# EAGLE design carrier1 (EAGLE 8.3.0)
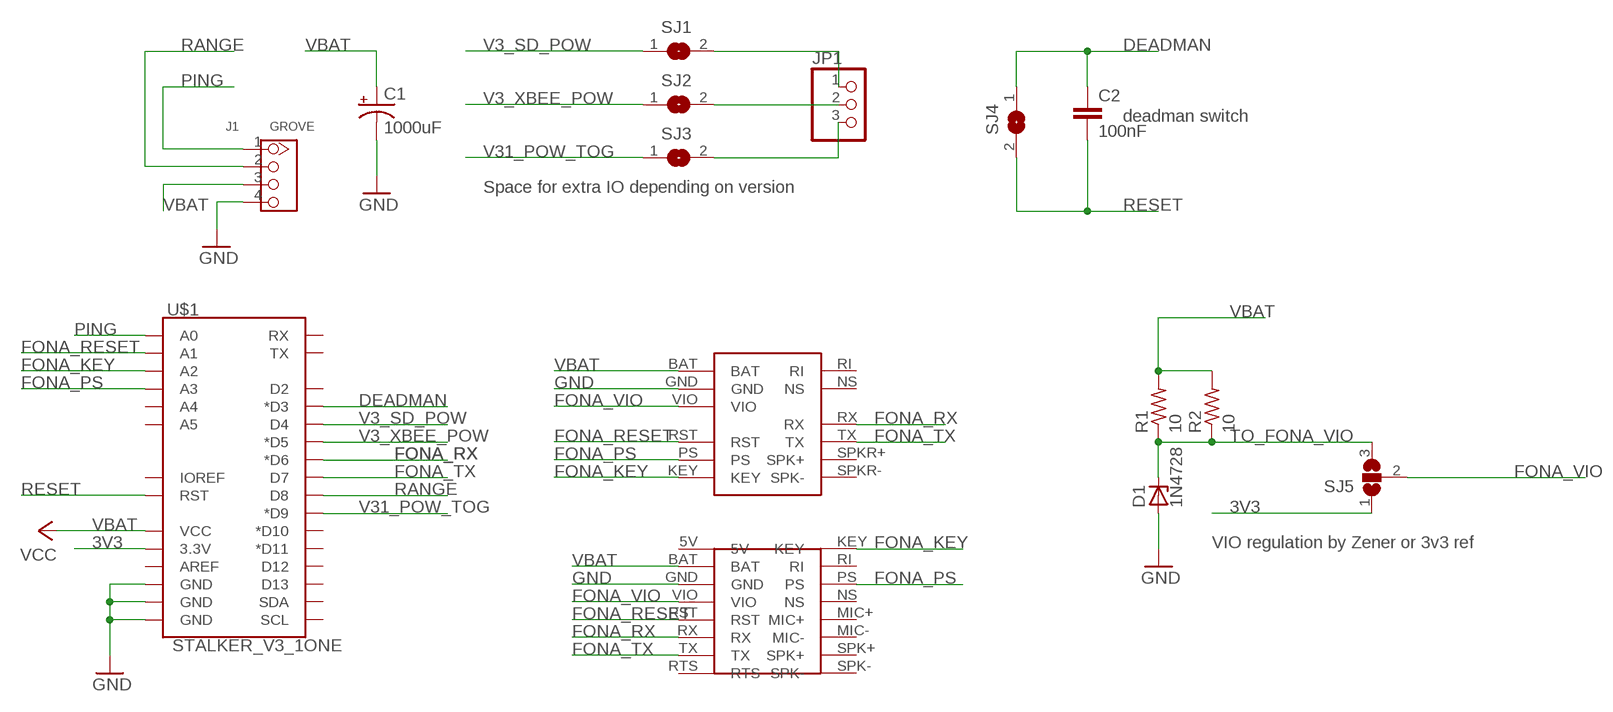
[diagram p0: schematic, sheet 1]

## Parts
C1  1000uF  CPOL-USE3.5-8  [E3,5-8]
C2  100nF  C-EUC0805  [C0805]
D1  1N4728  [DO41Z10]
J1  GROVE  GROVE-CONNECTOR-DIP(4P-2.0)  [HW4-2.0]
JP1  PINHD-1X3  [1X03]
R1  10  R-US_R0805  [R0805]
R2  10  R-US_0207/10  [0207/10]
SJ1  SJ  [SJ]
SJ2  SJ  [SJ]
SJ3  SJ  [SJ]
SJ4  SJ  [SJ]
SJ5  SJ2W  [SJ_2]
U$1  STALKER_V3_1ONE  [STALKER_V3_1_PACKAGE]
U$2  FONA_800_BREAKOUTONE  [FONA_800_H_L_BREAKOUT]
U$3  FONA_808_BREAKOUTONE  [FONA_808_BREAKOUT]

## Nets
3V3: SJ5.1 U$1.3.3V
DEADMAN: C2.1 SJ4.1 U$1.D3(*D3)
FONA_KEY: U$1.A2 U$2.KEY U$3.KEY
FONA_PS: U$1.A3 U$2.PS U$3.PS
FONA_RESET: U$1.A1 U$2.RST U$3.RST
FONA_RX: U$1.D6(*D6) U$2.RX U$3.RX
FONA_TX: U$1.D7 U$2.TX U$3.TX
FONA_VIO: SJ5.2 U$2.VIO U$3.VIO
GND: C1.- D1.A J1.4 U$1.GND@0(GND) U$1.GND@1(GND) U$1.GND@2(GND) U$2.GND U$3.GND
N$1: JP1.1 SJ1.2
N$2: JP1.2 SJ2.2
N$3: JP1.3 SJ3.2
PING: J1.1 U$1.A0
RANGE: J1.2 U$1.D8
RESET: C2.2 SJ4.2 U$1.RES(RST)
TO_FONA_VIO: D1.C R1.1 R2.1 SJ5.3
V3_SD_POW: SJ1.1 U$1.D4
V3_XBEE_POW: SJ2.1 U$1.D5(*D5)
V31_POW_TOG: SJ3.1 U$1.D9(*D9)
VBAT [POWER]: C1.+ J1.3 R1.2 R2.2 U$1.VCC U$2.BAT U$3.BAT ; supply symbol labelled VCC
Unconnected: U$1.A4 U$1.A5 U$1.AREF U$1.D2 U$1.D10(*D10) U$1.D11(*D11) U$1.D12 U$1.D13 U$1.IOREF U$1.RX U$1.SCL U$1.SDA U$1.TX U$2.NS U$2.RI U$2.SPKR+(SPK+) U$2.SPKR-(SPK-) U$3.MIC+ U$3.MIC- U$3.NS U$3.RI U$3.RTS U$3.SPK+ U$3.SPK-

## Notes on the sheet
- deadman switch
- Space for extra IO depending on version
- VIO regulation by Zener or 3v3 ref

## Power pins joined to a net without a drawn wire
5V: U$3.5V

## Library data of the parts
C1 = rcl:CPOL-US: POLARIZED CAPACITOR, American symbol
C2 = rcl:C-EU: CAPACITOR, European symbol
D1 = diode:1N4728: Z DIODE 3.3 V, 1W, 5 percent
J1 = TepmachchaMk2:GROVE-CONNECTOR-DIP(4P-2.0): 320110033; VALUE: 4P-2.0
JP1 = pinhead:PINHD-1X3: PIN HEADER
R1 R2 = rcl:R-US_: RESISTOR, American symbol
SJ1-SJ4 = jumper:SJ: SMD solder JUMPER
SJ5 = jumper:SJ2W: SMD solder JUMPER
U$1 = TepmachchaMk2:STALKER_V3_1: Stalker V3.1 device
U$2 = TepmachchaMk2:FONA_800_BREAKOUT: Adafruit FONA 800 H or L breakout board footprint and dimensions
U$3 = TepmachchaMk2:FONA_808_BREAKOUT

## Net classes
1 POWER: width 2.032 mm, drill 0.508 mm, clearance 1.016 mm

## Board
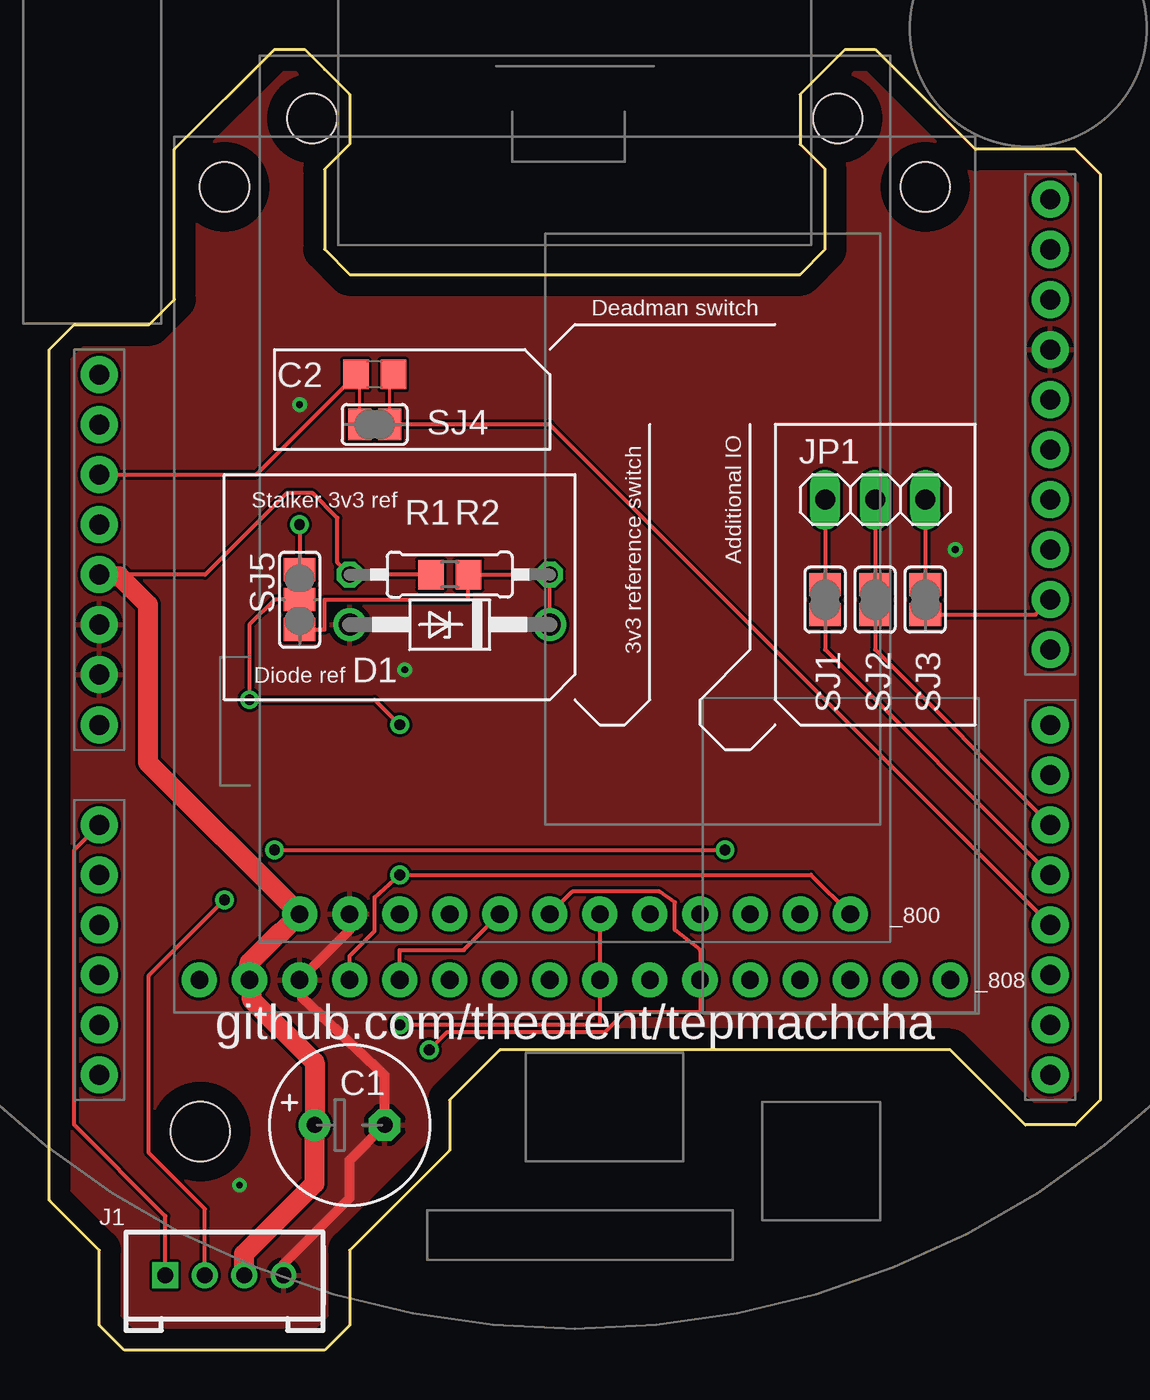
[diagram p1: board, top side]
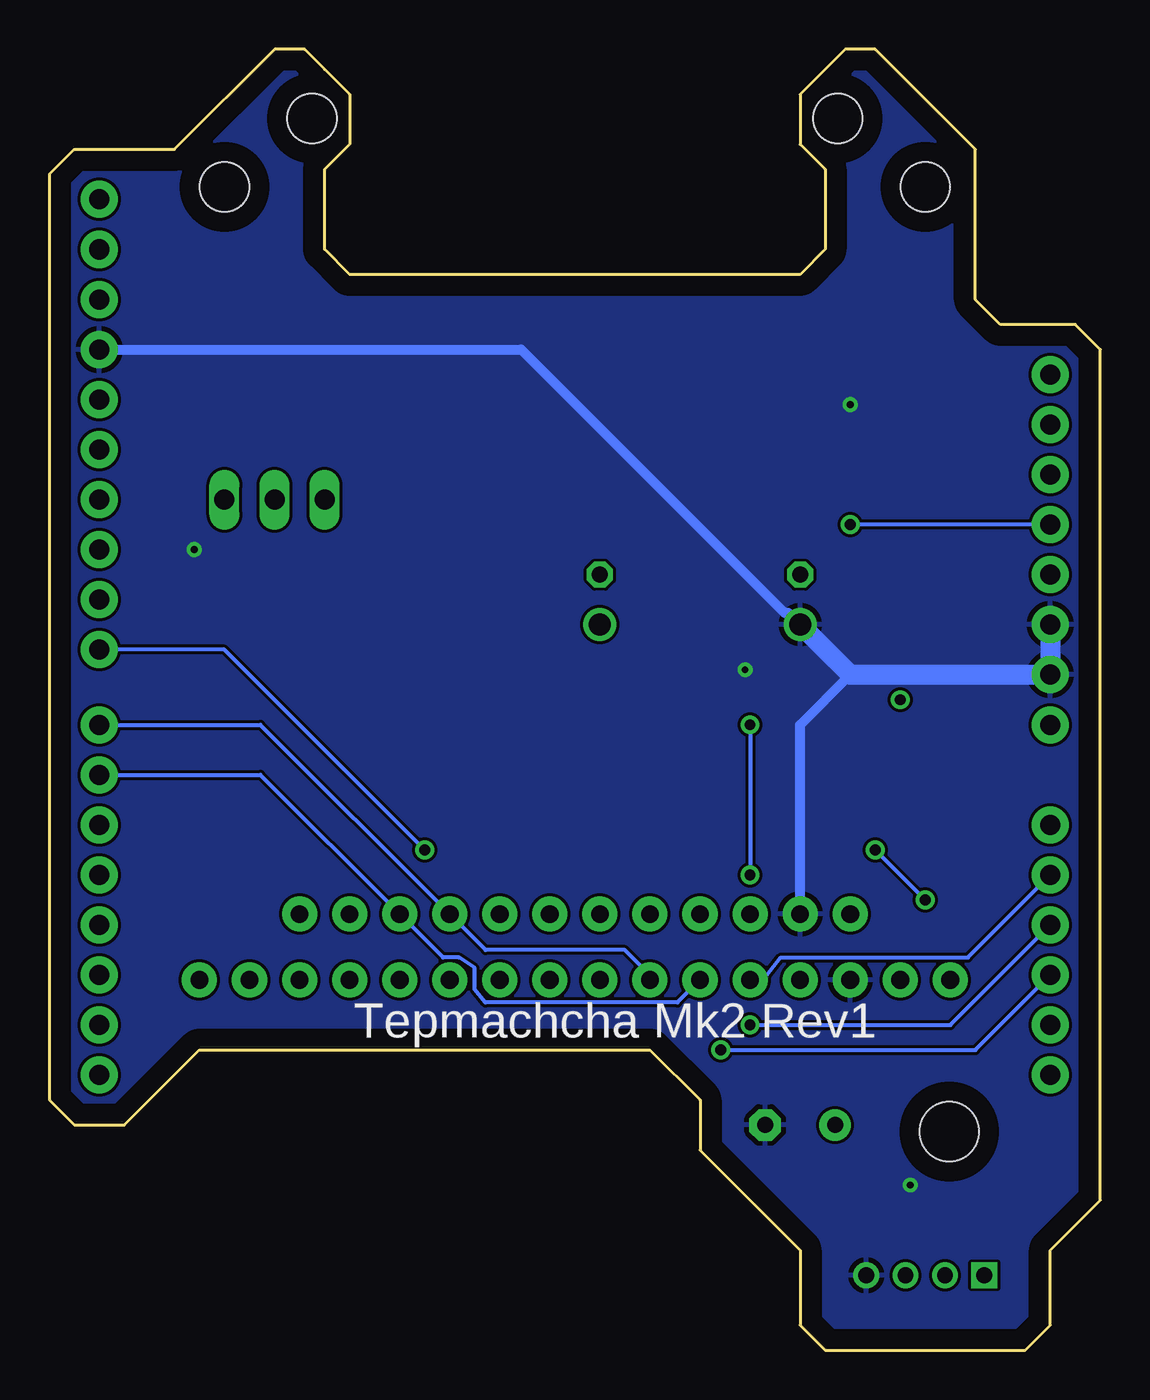
[diagram p2: board, bottom side, seen from below]

Size 53.34 x 66.04 mm. Coordinates in mm from the lower left corner, seen from the top.
Outline: 0,7.62 0,50.8 1.27,52.07 5.08,52.07 6.35,53.34 6.35,60.96 11.43,66.04 12.95,66.04 13.97,65.02 15.24,63.75 15.24,61.21 13.97,59.94 13.97,55.88 15.24,54.61 38.1,54.61 39.37,55.88 39.37,59.94 38.1,61.21 38.1,63.75 39.37,65.02 40.39,66.04 41.91,66.04 46.99,60.96 52.07,60.96 53.34,59.69 53.34,12.7 52.07,11.43 49.53,11.43 45.72,15.24 22.86,15.24 20.32,12.7 20.32,10.16 15.24,5.08 15.24,1.27 13.97,0 3.81,0 2.54,1.27 2.54,5.08 0,7.62
Copper layers (1*16): Top 0.035mm / dielectric 1.5mm / Bottom 0.035mm
Design rules "default": minimum track width 6mil, minimum drill 0.35mm, track to track 6mil, track to pad 6mil, pad to pad 6mil, via to via 6mil, smd to smd 6mil, copper to edge 40mil, drill to drill 6mil, minimum pad ring 10mil, minimum via ring 8mil, stop-mask expansion 4mil, vias tented up to drill 0mil, thermal gap 10mil

### Footprints (pad centres in the part's own frame; a part is rotated, then mirrored left to right if it is on the bottom)
E3,5-8 = drill 0.813 pad 1.6: + -1.778,0 | drill 0.813 pad 1.6 octagon: - 1.778,0
C0805 = smd 1.3 x 1.5: 1 -0.95,0; 2 0.95,0
DO41Z10 = drill 1.118: A 5.08,0; C -5.08,0
HW4-2.0 = drill 0.8 pad 1.27 square: 1 -3,0 | drill 0.8 pad 1.27: 2 -1,0; 3 1,0; 4 3,0
1X03 = drill 1.016 long: 1 -2.54,0; 2 0,0; 3 2.54,0
R0805 = smd 1.3 x 1.5: 1 -0.95,0; 2 0.95,0
0207/10 = drill 0.813 octagon: 1 -5.08,0; 2 5.08,0
SJ = smd 1.168 x 1.6: 1 -0.762,0; 2 0.762,0
SJ_2 = smd 1.168 x 1.6: 1 -1.524,0; 2 0,0; 3 1.524,0
STALKER_V3_1_PACKAGE = drill 1.016 pad 1.88: 3.3V -24.13,3.81; A0 -24.13,-11.43; A1 -24.13,-13.97; A2 -24.13,-16.51; A3 -24.13,-19.05; A4 -24.13,-21.59; A5 -24.13,-24.13; AREF 24.13,15.24; D2 24.13,-19.05; D3 24.13,-16.51; D4 24.13,-13.97; D5 24.13,-11.43; D6 24.13,-8.89; D7 24.13,-6.35; D8 24.13,-2.54; D9 24.13,0; D10 24.13,2.54; D11 24.13,5.08; D12 24.13,7.62; D13 24.13,10.16; GND@0 -24.13,-1.27; GND@1 -24.13,-3.81; GND@2 24.13,12.7; IOREF -24.13,8.89; NC@0 -24.13,-6.35; NC@1 -24.13,11.43; RES -24.13,6.35; RX 24.13,-24.13; SCL 24.13,20.32; SDA 24.13,17.78; TX 24.13,-21.59; VCC -24.13,1.27 | hole 3: -19,-27
FONA_800_H_L_BREAKOUT = drill 0.9 pad 1.778: BAT -13.97,-21.04; GND -11.43,-21.04; KEY 1.27,-21.04; NS 11.43,-21.04; PS -1.27,-21.04; RI 3.81,-21.04; RST -3.81,-21.04; RX 8.89,-21.04; SPKR+ -8.89,-21.04; SPKR- -6.35,-21.04; TX 6.35,-21.04; VIO 13.97,-21.04 | hole 2.5: -13.335,19.346; 13.335,19.346
FONA_808_BREAKOUT = drill 0.9 pad 1.778: 5V -19.05,-20.574; BAT -16.51,-20.574; GND -13.97,-20.574; KEY 1.27,-20.574; MIC+ 11.43,-20.574; MIC- 13.97,-20.574; NS 8.89,-20.574; PS 6.35,-20.574; RI 3.81,-20.574; RST -8.89,-20.574; RTS -1.27,-20.574; RX -6.35,-20.574; SPK+ 16.51,-20.574; SPK- 19.05,-20.574; TX -3.81,-20.574; VIO -11.43,-20.574 | hole 2.5: -17.78,19.685; 17.78,19.685

### Placement (x,y rotation side)
C1  15.24,11.43 0 top
C2  16.51,49.53 180 top
D1  20.32,36.83 180 top
J1  8.89,3.81 0 top
JP1  41.91,43.18 0 top
R1  20.32,39.37 180 top
R2  20.32,39.37 180 top
SJ1  39.37,38.1 90 top
SJ2  41.91,38.1 90 top
SJ3  44.45,38.1 90 top
SJ4  16.51,46.99 180 top
SJ5  12.7,38.1 270 top
U$1  26.67,38.1 0 top
U$2  26.67,43.18 0 top
U$3  26.67,39.37 0 top

### Tracks (layer width: path | path; a pad name or v marks a point on that pad's centre or on a via)
3V3  (via drill 0.55)
  Top 0.203: v12.7,41.91 SJ5.1
  Bottom 0.203: U$1.3.3V v12.7,41.91
DEADMAN
  Top 0.152: SJ4.1 17.27,49.34 C2.1
  Top 0.203: U$1.D3 25.4,46.99 SJ4.1
FONA_KEY  (via drill 0.55)
  Top 0.203: U$2.KEY U$3.KEY 27.94,16.51 v17.78,16.51
  Bottom 0.203: v17.78,16.51 7.62,16.51 U$1.A2
FONA_PS  (via drill 0.55)
  Top 0.203: U$2.PS 26.54,23.28 30.95,23.28 31.75,22.74 31.75,21.34 33.02,20.32 U$3.PS 33.02,17.14 29.21,17.14 28.19,16.13 20.16,16.13 v19.27,15.24
  Bottom 0.203: v19.27,15.24 6.35,15.24 U$1.A3
FONA_RESET
  Top 0.203: U$3.RST 17.78,20.32 21.04,20.32 U$2.RST
  Bottom 0.203: U$3.RST 17.11,18.8 16.22,19.94 6.73,19.94 U$1.A1
FONA_RX
  Bottom 0.203: U$1.D6 42.63,29.21 U$2.RX 33.36,19.94 32.55,19.94 31.75,19.4 31.75,18.32 31.21,17.65 21.46,17.65 U$3.RX
FONA_TX
  Bottom 0.203: U$1.D7 42.63,31.75 33.04,22.16 | 33.04,22.16 U$2.TX | U$3.TX 22.86,19.05 24.13,20.32 31.2,20.32 33.04,22.16
FONA_VIO  (via drill 0.55)
  Top 0.203: U$3.VIO 15.24,20.02 16.51,21.29 16.51,22.99 v17.78,24.13 38.65,24.13 U$2.VIO | SJ5.2 11.43,38.1 10.16,36.83 v10.16,33.02 16.51,33.02 v17.78,31.75
  Bottom 0.203: v17.78,31.75 v17.78,24.13
GND  (via drill 0.35)
  Top 0.508: J1.4 11.89,4.38 15.24,7.73 15.24,9.65 C1.- 17.02,13.96 12.83,17.9 U$3.GND 15.24,21.34 U$2.GND
  Bottom 0.508: D1.A 15.85,37.44 16.04,37.44 29.4,50.8 U$1.GND@2 | U$2.GND 15.24,31.75 12.7,34.29
  Bottom 1.016: U$1.GND@0 U$1.GND@1 12.7,34.29 D1.A
  other vias: 9.65,8.38 12.7,48.01 18.03,34.54 45.97,40.64
  pour Top: -2.54,-2.54 -2.54,68.58 55.88,68.58 55.88,10.16 22.86,10.16 22.86,-2.54
  pour Bottom: -5.08,71.12 58.42,71.12 58.42,7.62 25.4,7.62 25.4,-5.08 -5.08,-5.08
N$1
  Top 0.203: JP1.1 SJ1.2
N$2
  Top 0.203: JP1.2 SJ2.2
N$3
  Top 0.203: JP1.3 SJ3.2
PING
  Top 0.203: J1.1 5.89,6.81 1.27,11.43 1.27,25.4 U$1.A0
RANGE  (via drill 0.55)
  Top 0.203: J1.2 7.89,7.18 5.05,10.02 5.05,19.02 v8.89,22.86 | v11.43,25.4 v34.29,25.4
  Bottom 0.203: v8.89,22.86 v11.43,25.4 | v34.29,25.4 44.45,35.56 U$1.D8
RESET
  Top 0.152: SJ4.2 15.75,49.34 C2.2
  Top 0.203: U$1.RES 10.5,44.45 C2.2
TO_FONA_VIO
  Top 0.203: D1.C R2.1 R1.1 21.27,38.1 13.97,38.1 13.97,36.58 SJ5.3
V3_SD_POW
  Top 0.203: SJ1.1 39.37,35.56 U$1.D4
V3_XBEE_POW
  Top 0.203: SJ2.1 41.91,35.56 U$1.D5
V31_POW_TOG
  Top 0.203: SJ3.1 50.04,37.34 U$1.D9
VBAT
  Top 0.203: R1.2 R2.2 14.62,39.99 14.62,42.25 13.36,43.51 12.04,43.51 7.9,39.37 2.69,39.37 2.62,39.29
  Top 1.016: U$1.VCC 2.62,39.29 3.56,39.29 5,37.85 5,29.84 U$2.BAT 11.77,21.21 11.7,21.21 10.16,19.67 U$3.BAT 10.29,18.67 10.29,17.8 13.46,14.62 C1.+ 13.46,8.46 9.89,4.89 J1.3

### Text on the board
tPlace: Deadman switch | Stalker 3v3 ref | Additional IO | 3v3 reference switch | Diode ref | _800 | _808 | github.com/theorent/tepmachcha
bPlace: Tepmachcha Mk2 Rev1